# EAGLE design scr (EAGLE 9.5.2)
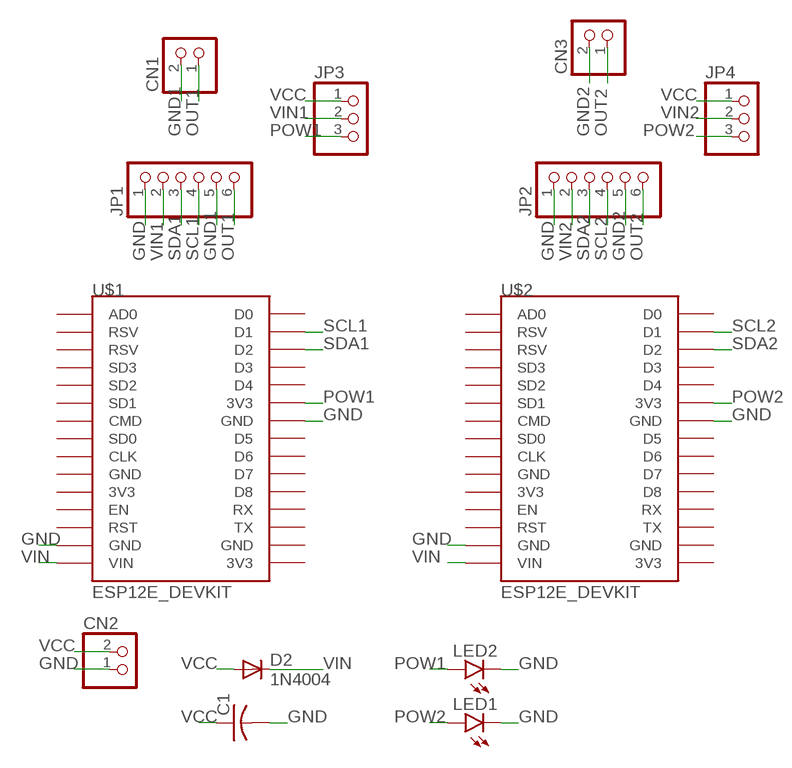
[diagram p0: schematic, sheet 1]

## Parts
C1  C-US025-040X050  [C025-040X050]
CN1  JST_2PIN-THM  [JST-PH-2-THM]
CN2  JST_2PIN-THM  [JST-PH-2-THM]
CN3  JST_2PIN-THM  [JST-PH-2-THM]
D2  1N4004  [DO41-10]
JP1  PINHD-1X6  [1X06]
JP2  PINHD-1X6  [1X06]
JP3  PINHD-1X3CB  [1X03-CLEANBIG]
JP4  PINHD-1X3CB  [1X03-CLEANBIG]
LED1  LED5MM  [LED5MM]
LED2  LED5MM  [LED5MM]
U$1  ESP12E_DEVKIT  [ESP12E_DEVKIT]
U$2  ESP12E_DEVKIT  [ESP12E_DEVKIT]

## Nets
GND: C1.2 CN2.1 JP1.1 JP2.1 LED1.K(C) LED2.K(C) U$1.GND@1(GND) U$1.GND@2(GND) U$2.GND@1(GND) U$2.GND@2(GND)
GND1: CN1.2 JP1.5
GND2: CN3.2 JP2.5
OUT1: CN1.1 JP1.6
OUT2: CN3.1 JP2.6
POW1: JP3.3 LED2.A U$1.3V3@1(3V3)
POW2: JP4.3 LED1.A U$2.3V3@1(3V3)
SCL1: JP1.4 U$1.D1
SCL2: JP2.4 U$2.D1
SDA1: JP1.3 U$1.D2
SDA2: JP2.3 U$2.D2
VCC: C1.1 CN2.2 D2.A JP3.1 JP4.1
VIN: D2.C U$1.VIN U$2.VIN
VIN1: JP1.2 JP3.2
VIN2: JP2.2 JP4.2
Unconnected: U$1.3V3@0(3V3) U$1.3V3@2(3V3) U$1.AD0 U$1.CLK U$1.CMD U$1.D0 U$1.D3 U$1.D4 U$1.D5 U$1.D6 U$1.D7 U$1.D8 U$1.EN U$1.GND@0(GND) U$1.GND@3(GND) U$1.RST U$1.RSV@0(RSV) U$1.RSV@1(RSV) U$1.RX U$1.SD0 U$1.SD1 U$1.SD2 U$1.SD3 U$1.TX U$2.3V3@0(3V3) U$2.3V3@2(3V3) U$2.AD0 U$2.CLK U$2.CMD U$2.D0 U$2.D3 U$2.D4 U$2.D5 U$2.D6 U$2.D7 U$2.D8 U$2.EN U$2.GND@0(GND) U$2.GND@3(GND) U$2.RST U$2.RSV@0(RSV) U$2.RSV@1(RSV) U$2.RX U$2.SD0 U$2.SD1 U$2.SD2 U$2.SD3 U$2.TX

## Library data of the parts
C1 = adafruit:C-US: CAPACITOR, American symbol
CN1-CN3 = adafruit:JST_2PIN: JST 2-Pin Connectors of various flavors SMT-RA (S2B-PH-SM4) 4UConnector #17311 SMT (B2B-PH-SM4) THM-RA (S2B-PH) THM (B2B-PH)
D2 = adafruit:1N4004: DIODE General purpose 1N400x type rectifier (With bigger pads) http://www.ladyada.net/library/pcb/eaglelibrary.html
JP1 JP2 = adafruit:PINHD-1X6: PIN HEADER
JP3 JP4 = adafruit:PINHD-1X3: PIN HEADER
LED1 LED2 = led:LED: LED OSRAM: - CHIPLED LG R971, LG N971, LY N971, LG Q971, LY Q971, LO R971, LY R971 LH N974, LH R974 LS Q976, LO Q976, LY Q976 LO Q996 - Hyper CHIPLED LW Q18S LB Q993, LB Q99A, LB R99A - SideLED LS A670, LO A670, LY A670, LG A670, LP A670 LB A673, LV A673, LT A673, LW A673 LH A674 LY A675 LS A676, LA A676, LO A676, LY A676, LW A676 LS A679, LY A679, LG A679 - Hyper Micro SIDELED® LS Y876, LA Y876, LO Y876, LY Y876 LT Y87S - SmartLED LW L88C, LW L88S LB L89C, LB L89S, LG L890 LS L89K, LO L89K, LY L89K LS L896, LA L896, LO L896, LY L896 - TOPLED LS T670, LO T670, LY T670, LG T670, LP T670 LSG T670, LSP T670, LSY T670, LOP T670, LYG T670 LG T671, LOG T671, LSG T671 LB T673, LV T673, LT T673, LW T673 LH T674 LS T676, LA T676, LO T676, LY T676, LB T676, LH T676, LSB T676, LW T676 LB T67C, LV T67C, LT T67C, LS T67K, LO T67K, LY T67K, LW E67C LS E67B, LA E67B, LO E67B, LY E67B, LB E67C, LV E67C, LT E67C LW T67C LS T679, LY T679, LG T679 LS T770, LO T770, LY T770, LG T770, LP T770 LB T773, LV T773, LT T773, LW T773 LH T774 LS E675, LA E675, LY E675, LS T675 LS T776, LA T776, LO T776, LY T776, LB T776 LHGB T686 LT T68C, LB T68C - Hyper Mini TOPLED® LB M676 - Mini TOPLED Santana® LG M470 LS M47K, LO M47K, LY M47K Source: http://www.osram.convergy.de LUXEON: - LUMILED® LXK2-PW12-R00, LXK2-PW12-S00, LXK2-PW14-U00, LXK2-PW14-V00 LXK2-PM12-R00, LXK2-PM12-S00, LXK2-PM14-U00 LXK2-PE12-Q00, LXK2-PE12-R00, LXK2-PE12-S00, LXK2-PE14-T00, LXK2-PE14-U00 LXK2-PB12-K00, LXK2-PB12-L00, LXK2-PB12-M00, LXK2-PB14-N00, LXK2-PB14-P00, LXK2-PB14-Q00 LXK2-PR12-L00, LXK2-PR12-M00, LXK2-PR14-Q00, LXK2-PR14-R00 LXK2-PD12-Q00, LXK2-PD12-R00, LXK2-PD12-S00 LXK2-PH12-R00, LXK2-PH12-S00 LXK2-PL12-P00, LXK2-PL12-Q00, LXK2-PL12-R00 Source: www.luxeon.com KINGBRIGHT: KA-3528ASYC Source: www.kingbright.com
U$1 U$2 = ESP12E_DEVKIT:ESP12E_DEVKIT: ESP12E DEVKIT BOARD

## Board
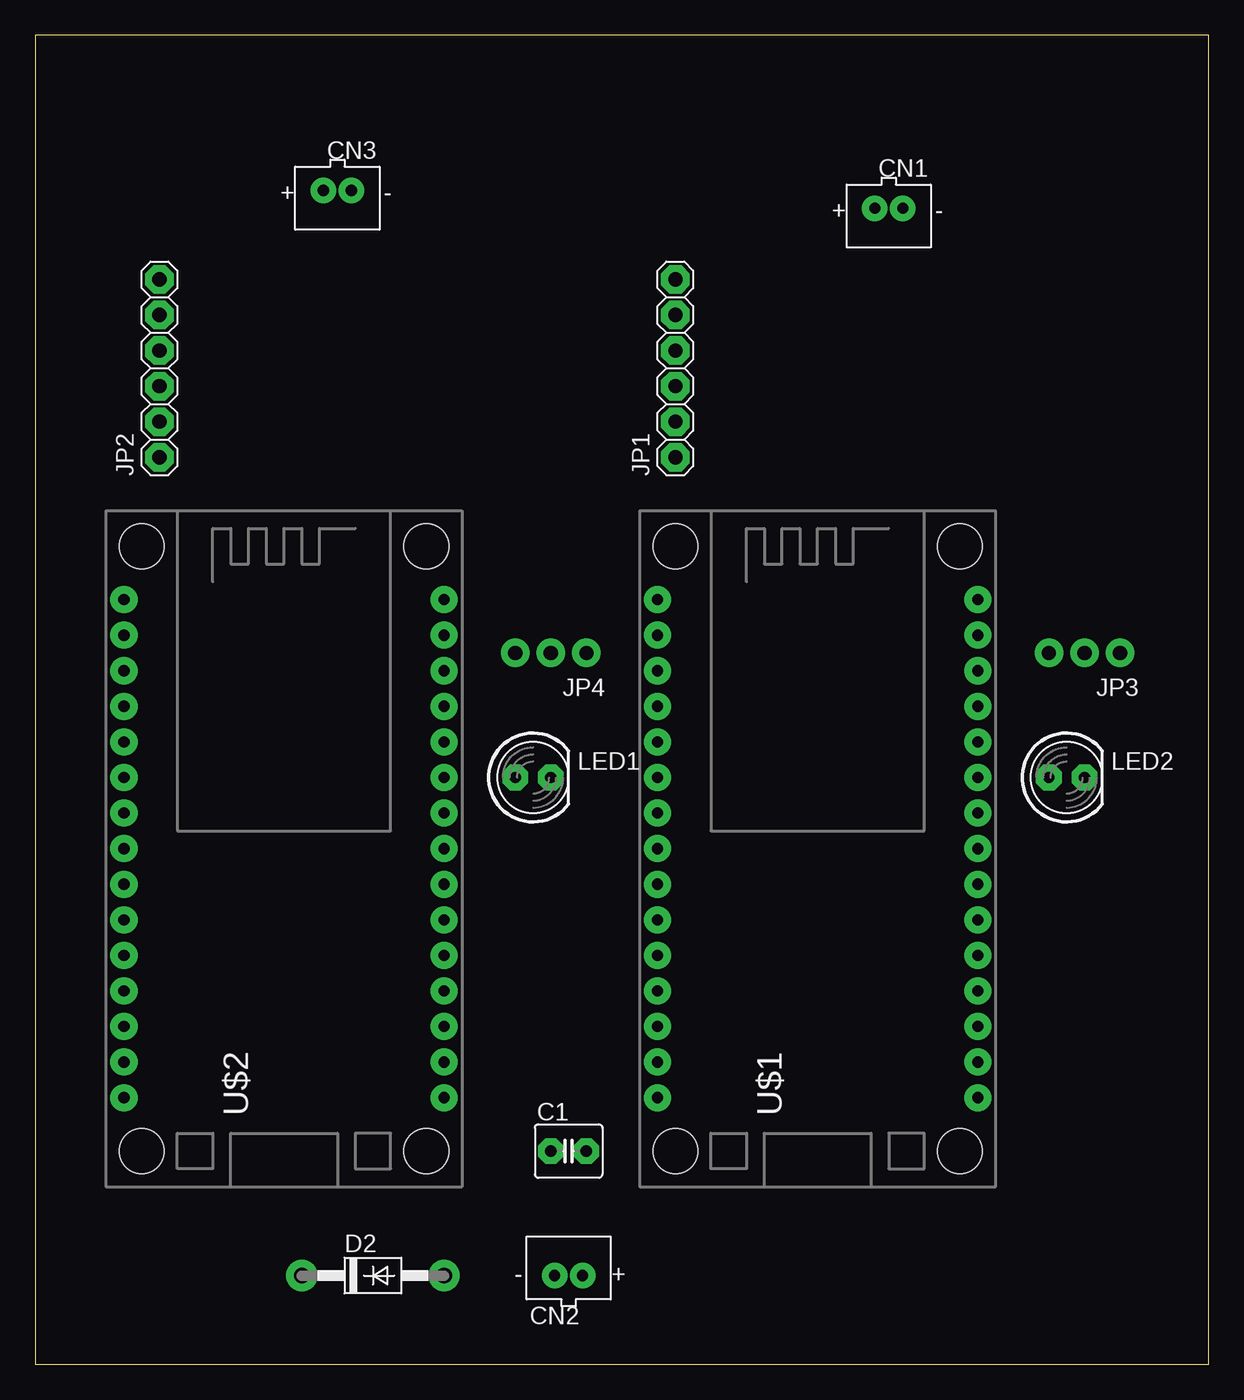
[diagram p1: board, top side]
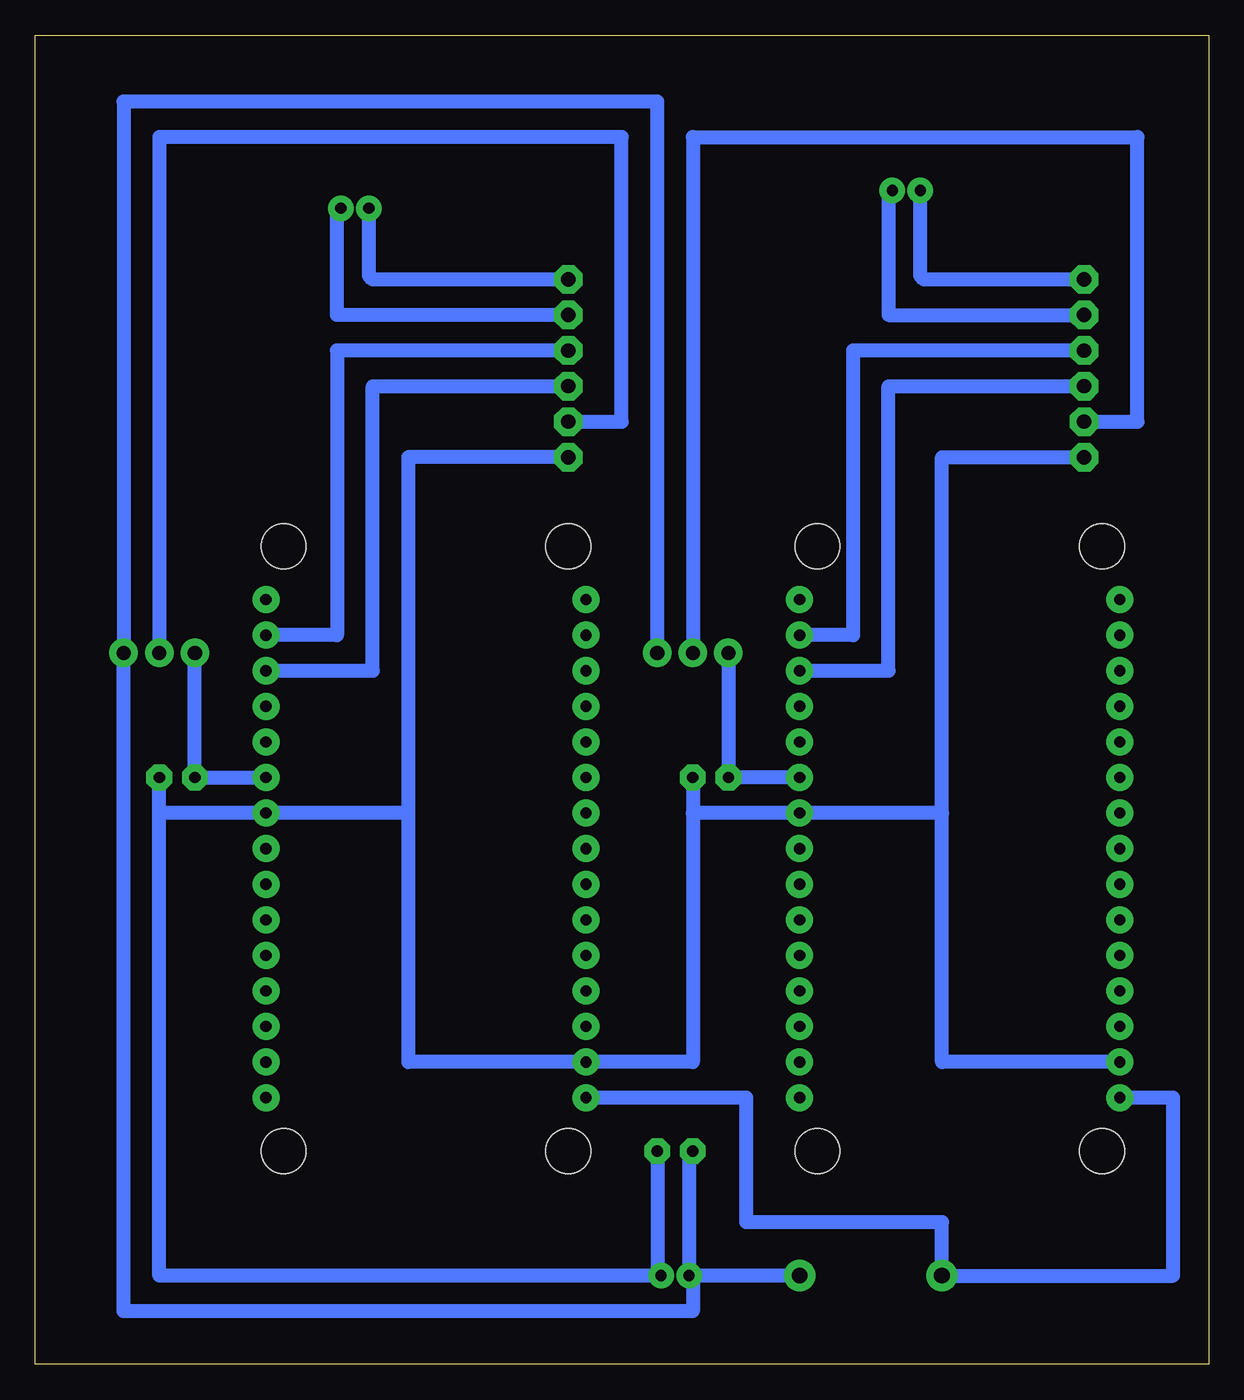
[diagram p2: board, bottom side, seen from below]

Size 83.8 x 94.92 mm. Coordinates in mm from the lower left corner, seen from the top.
Outline: 0,0 83.8,0 83.8,94.92 0,94.92 0,0
Copper layers (1*16): Top 0.035mm / dielectric 1.5mm / Bottom 0.035mm
Design rules "Old": minimum track width 1mm, minimum drill 1mm, track to track 16mil, track to pad 16mil, pad to pad 16mil, via to via 16mil, smd to smd 6mil, copper to edge 30mil, drill to drill 6mil, minimum pad ring 20mil, minimum via ring 8mil, stop-mask expansion 4mil, vias tented up to drill 0mil, thermal gap 10mil

### Footprints (pad centres in the part's own frame; a part is rotated, then mirrored left to right if it is on the bottom)
C025-040X050 = drill 0.813 pad 1.422 octagon: 1 -1.27,0; 2 1.27,0
JST-PH-2-THM = drill 0.8 pad 1.422: 1 1,0; 2 -1,0
DO41-10 = drill 1.118 pad 1.93: A 5.08,0; C -5.08,0
1X06 = drill 1.016 octagon: 1 -6.35,0; 2 -3.81,0; 3 -1.27,0; 4 1.27,0; 5 3.81,0; 6 6.35,0
1X03-CLEANBIG = drill 1.016 pad 1.676: 1 -2.54,0; 2 0,0; 3 2.54,0
LED5MM = drill 0.813 octagon: A -1.27,0; K 1.27,0
ESP12E_DEVKIT = drill 0.8 pad 1.93: 3V3@0 -11.43,-7.62; 3V3@1 11.43,5.08; 3V3@2 11.43,-17.78; AD0 -11.43,17.78; CLK -11.43,-2.54; CMD -11.43,2.54; D0 11.43,17.78; D1 11.43,15.24; D2 11.43,12.7; D3 11.43,10.16; D4 11.43,7.62; D5 11.43,0; D6 11.43,-2.54; D7 11.43,-5.08; D8 11.43,-7.62; EN -11.43,-10.16; GND@0 -11.43,-5.08; GND@1 -11.43,-15.24; GND@2 11.43,2.54; GND@3 11.43,-15.24; RST -11.43,-12.7; RSV@0 -11.43,15.24; RSV@1 -11.43,12.7; RX 11.43,-10.16; SD0 -11.43,0; SD1 -11.43,5.08; SD2 -11.43,7.62; SD3 -11.43,10.16; TX 11.43,-12.7; VIN -11.43,-17.78 | hole 3.2: -10.16,21.59; 10.16,21.59; 10.16,-21.59; -10.16,-21.59

### Placement (x,y rotation side)
C1  38.1,15.24 0 top
CN1  60.96,82.55 180 top
CN2  38.1,6.35 0 top
CN3  21.59,83.82 180 top
D2  24.13,6.35 0 top
JP1  45.72,71.12 90 top
JP2  8.89,71.12 90 top
JP3  74.93,50.8 180 top
JP4  36.83,50.8 180 top
LED1  35.56,41.91 0 top
LED2  73.66,41.91 0 top
U$1  55.88,36.83 0 top
U$2  17.78,36.83 0 top

### Tracks (layer width: path | path; a pad name or v marks a point on that pad's centre or on a via)
GND
  Bottom 1: C1.2 39.37,6.62 CN2.1 74.93,6.35 74.93,39.37 | U$2.GND@1 19.05,21.59 19.05,39.37 | 19.05,39.37 U$2.GND@2 36.83,39.37 | 57.15,39.37 57.15,21.59 U$1.GND@1 36.83,21.59 36.83,39.37 | 57.15,39.37 U$1.GND@2 74.93,39.37 | LED1.K 36.83,39.37 | 74.93,39.37 LED2.K | 19.05,39.37 19.05,64.77 JP2.1 | 57.15,39.37 57.15,64.77 JP1.1
GND1
  Bottom 1: JP1.5 62.23,74.93 62.23,82.28 CN1.2
GND2
  Bottom 1: CN3.2 22.86,83.55 22.86,74.93 JP2.5
OUT1
  Bottom 1: JP1.6 59.69,77.47 59.96,77.74 CN1.1
OUT2
  Bottom 1: JP2.6 20.32,77.47 20.59,77.74 CN3.1
POW1
  Bottom 1: U$1.3V3@1 LED2.A JP3.3
POW2
  Bottom 1: U$2.3V3@1 LED1.A JP4.3
SCL1
  Bottom 1: JP1.4 62.23,72.39 62.23,52.07 U$1.D1
SCL2
  Bottom 1: JP2.4 25.4,72.39 25.4,52.07 U$2.D1
SDA1
  Bottom 1: U$1.D2 59.69,49.53 59.69,69.85 JP1.3
SDA2
  Bottom 1: U$2.D2 22.86,49.53 22.86,69.85 JP2.3
VCC
  Bottom 1: C1.1 37.1,14.97 CN2.2 | D2.A CN2.2 | CN2.2 36.83,6.08 36.83,3.81 77.47,3.81 JP3.1 77.47,90.17 39.37,90.17 JP4.1
VIN
  Bottom 1: U$2.VIN 2.54,19.05 2.54,6.35 D2.C 19.05,10.16 33.02,10.16 33.02,19.05 U$1.VIN
VIN1
  Bottom 1: JP3.2 74.93,87.63 41.91,87.63 41.91,67.31 JP1.2
VIN2
  Bottom 1: JP4.2 36.83,87.63 5.08,87.63 5.08,67.31 JP2.2